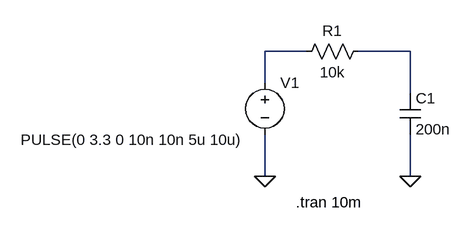
[diagram p0: schematic pwm-rc-filter.asc]
pwm-rc-filter.asc, the LTspice schematic file:
Version 4.1
SHEET 1 880 680
WIRE 112 80 48 80
WIRE 272 80 192 80
WIRE 48 128 48 80
WIRE 272 144 272 80
WIRE 48 272 48 208
WIRE 272 272 272 208
FLAG 48 272 0
FLAG 272 272 0
SYMBOL res 208 64 R90
WINDOW 0 0 56 VBottom 2
WINDOW 3 32 56 VTop 2
SYMATTR InstName R1
SYMATTR Value 10k
SYMBOL cap 256 144 R0
SYMATTR InstName C1
SYMATTR Value 200n
SYMBOL voltage 48 112 R0
WINDOW 3 -376 104 Left 2
WINDOW 123 0 0 Left 0
WINDOW 39 0 0 Left 0
SYMATTR Value PULSE(0 3.3 0 10n 10n 5u 10u)
SYMATTR InstName V1
TEXT 96 312 Left 2 !.tran 10m

The netlist it stands for:
* pwm-rc-filter.asc
R1 N002 N001 10k
C1 N002 0 200n
V1 N001 0 PULSE(0 3.3 0 10n 10n 5u 10u)
.tran 10m
.backanno
.end